# Altium project aesh.PrjPcb
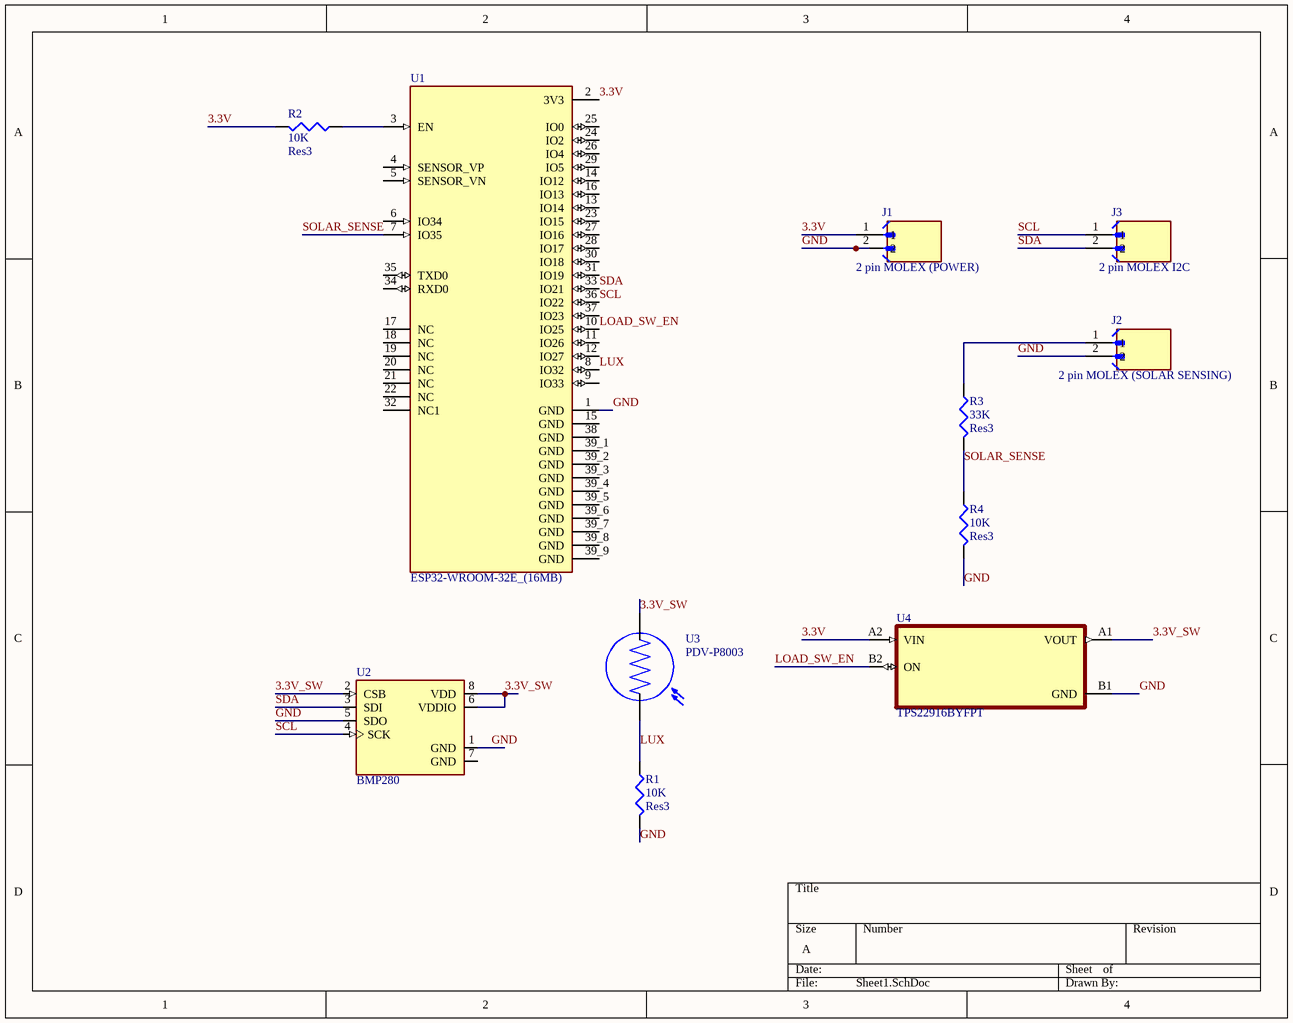
[diagram p0: Sheet1.SchDoc]
1 sheet, 11 parts. Net scope: global (net labels, ports and power ports of the same name join across sheets).
Board file: PCB1.PcbDoc

## Sheet Sheet1.SchDoc
size A; SheetNumber: 1; SheetTotal: 1

### Parts
J1  2 pin MOLEX (POWER)  [TE_5-1775443-2]
J2  2 pin MOLEX (SOLAR SENSING)  [TE_5-1775443-2]
J3  2 pin MOLEX I2C  [TE_5-1775443-2]
R1  Res3  value 10K  [J1-0603]
R2  Res3  value 10K  [J1-0603]
R3  Res3  value 33K  [J1-0603]
R4  Res3  value 10K  [J1-0603]
U1  ESP32-WROOM-32E_(16MB)  [XCVR_ESP32-WROOM-32E_(16MB)]
U2  BMP280  [XDCR_BMP280]
U3  PDV-P8003  [XDCR_PDV-P8003]
U4  TPS22916BYFPT  [BGA4C40P2X2_77X77X50]

### Nets
3.3V: J1.1 R2.2 U1.2(3V3) U4.A2(VIN)
3.3V_SW: U2.2(CSB) U2.6(VDDIO) U2.8(VDD) U3.1 U4.A1(VOUT)
GND: J1.2 J2.2 R1.2 R4.2 U1.1(GND) U2.1(GND) U2.5(SDO) U4.B1(GND)
LOAD_SW_EN: U1.10(IO25) U4.B2(ON)
LUX: R1.1 U1.8(IO32) U3.2
SCL: J3.1 U1.36(IO22) U2.4(SCK)
SDA: J3.2 U1.33(IO21) U2.3(SDI)
SOLAR_SENSE: R3.2 R4.1 U1.7(IO35)
NetJ2_1: J2.1 R3.1
NetR2_1: R2.1 U1.3(EN)

Not connected (* = marked no-connect by the designer): U1 4(SENSOR_VP) 5(SENSOR_VN) 6(IO34) 9(IO33) 11(IO26) 12(IO27) 13(IO14) 14(IO12) 15(GND) 16(IO13) 17(NC) 18(NC) 19(NC) 20(NC) 21(NC) 22(NC) 23(IO15) 24(IO2) 25(IO0) 26(IO4) 27(IO16) 28(IO17) 29(IO5) 30(IO18) 31(IO19) 32(NC1) 34(RXD0) 35(TXD0) 37(IO23) 38(GND) 39_1(GND) 39_2(GND) 39_3(GND) 39_4(GND) 39_5(GND) 39_6(GND) 39_7(GND) 39_8(GND) 39_9(GND); U2 7(GND)

### Library data of the parts
J1-J3 = 5-1775443-2: Conn High Performance Interconnect HDR 2 POS 1.5mm Solder ST SMD T/R; MF: TE Connectivity; SnapEDA_Link: https://www.snapeda.com/parts/5-1775443-2/TE+Connectivity+AMP+Connectors/view-part/?ref=snap; Package: None; Value: *; MP: 5-1775443-2; EU_RoHS_Compliance: Compliant; Check_prices: https://www.snapeda.com/parts/5-1775443-2/TE+Connectivity+AMP+Connectors/view-part/?ref=eda
R1-R4 = Res3: Resistor; Published: 8-Jun-2000; LatestRevisionDate: 29-May-2009; LatestRevisionNote: IPC-7351 Footprint Added.; PackageReference: J1-0603; Publisher: Altium Limited; PackageDescription: Chip Resistor
U1 = ESP32-WROOM-32E_(16MB): Bluetooth, WiFi 802.11b/g/n, Bluetooth v4.2 +EDR, Class 1, 2 and 3 Transceiver Module 2.4GHz ~ 2.5GHz Integrated, Trace Surface Mount; MP: ESP32-WROOM-32E (16MB); MF: Espressif Systems; Price: None; Availability: Not in stock; Package: None; Value: *; SnapEDA_Link: https://www.snapeda.com/parts/ESP32-WROOM-32E%20(16MB)/Espressif+Systems/view-part/?ref=snap; Check_prices: https://www.snapeda.com/parts/ESP32-WROOM-32E%20(16MB)/Espressif+Systems/view-part/?ref=eda
U2 = BMP280: BMP280 Absolute Barometric Pressure Sensor for Battery Powered Devices 2 x 2.5mm; Package: None; Availability: Unavailable; MP: BMP280; Value: *; Price: None
U3 = PDV-P8003: CdS Cells 520nm 16 ~ 33kOhms @ 10 lux; MF: Advanced Photonix; SnapEDA_Link: https://www.snapeda.com/parts/PDV-P8003/Advanced+Photonix/view-part/?ref=snap; Package: Radial Advanced Photonix; Value: *; MP: PDV-P8003; Check_prices: https://www.snapeda.com/parts/PDV-P8003/Advanced+Photonix/view-part/?ref=eda
U4 = TPS22916BYFPT: 5.5-V, 2-A, 60-mÎ©, 10-nA leakage load switch with output discharge; MF: Texas Instruments; SnapEDA_Link: https://www.snapeda.com/parts/TPS22916BYFPT/Texas+Instruments/view-part/?ref=snap; Package: DSBGA-4 Texas Instruments; Value: *; MP: TPS22916BYFPT; Check_prices: https://www.snapeda.com/parts/TPS22916BYFPT/Texas+Instruments/view-part/?ref=eda